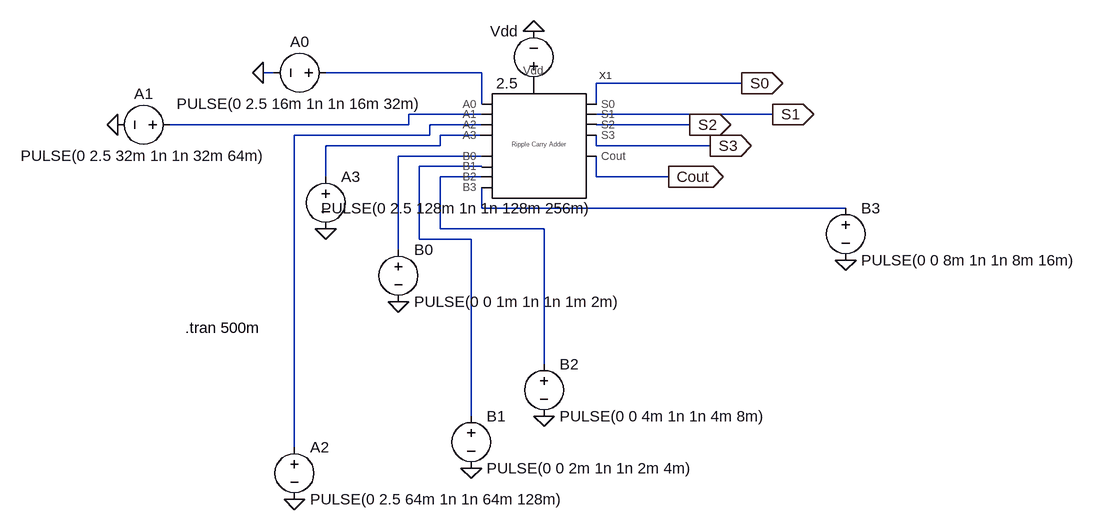
[diagram p0: schematic RippleAdder_transient.asc]
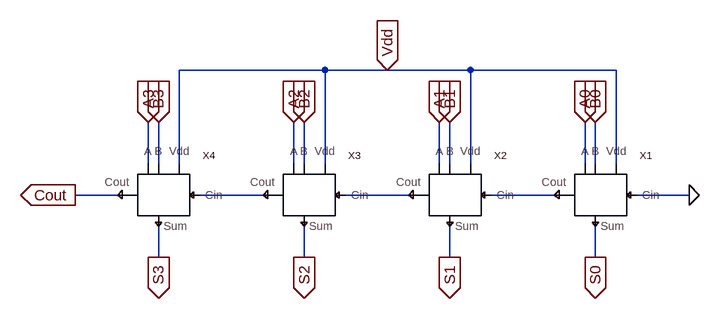
[diagram p1: sub-circuit rippleadder.asc]
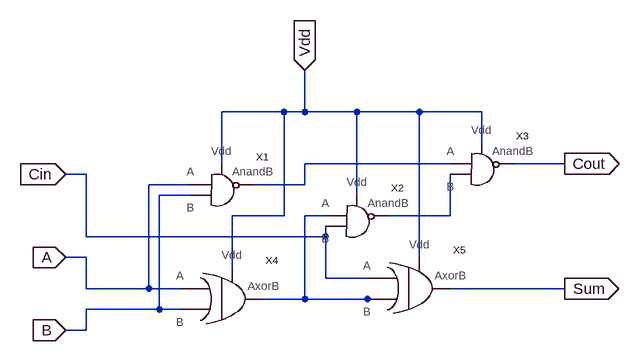
[diagram p2: sub-circuit fa.asc]
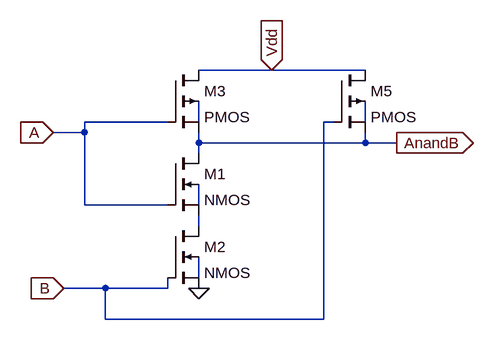
[diagram p3: sub-circuit nand.asc]
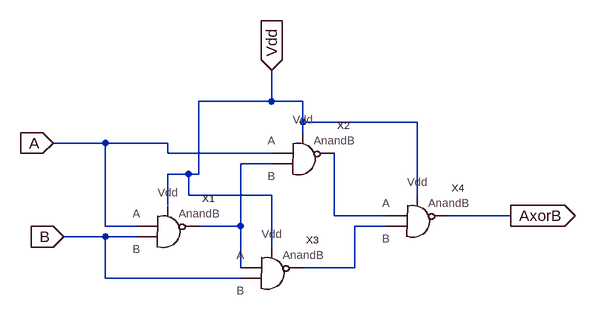
[diagram p4: sub-circuit xor.asc]
RippleAdder_transient.asc, the LTspice schematic file:
Version 4
SHEET 1 1164 680
WIRE -112 -32 -128 -32
WIRE 208 -32 -32 -32
WIRE 608 -16 384 -16
WIRE 208 16 208 -32
WIRE 384 16 384 -16
WIRE 208 32 96 32
WIRE 656 32 384 32
WIRE 96 48 96 32
WIRE 96 48 -272 48
WIRE 208 48 128 48
WIRE 528 48 384 48
WIRE 128 64 128 48
WIRE 128 64 -80 64
WIRE 208 64 144 64
WIRE 144 80 144 64
WIRE 144 80 -32 80
WIRE 384 80 384 64
WIRE 560 80 384 80
WIRE 208 96 80 96
WIRE 208 112 112 112
WIRE -32 128 -32 80
WIRE 208 128 144 128
WIRE 384 128 384 96
WIRE 496 128 384 128
WIRE 208 176 208 144
WIRE 768 176 208 176
WIRE 144 208 144 128
WIRE 304 208 144 208
WIRE 112 224 112 112
WIRE 192 224 112 224
WIRE 80 240 80 96
WIRE 304 416 304 208
WIRE 192 496 192 224
WIRE -80 544 -80 64
FLAG -32 208 0
FLAG -80 624 0
FLAG -352 48 0
FLAG -128 -32 0
FLAG 192 576 0
FLAG 304 496 0
FLAG 768 256 0
FLAG 80 320 0
FLAG 288 -96 0
FLAG 608 -16 S0
IOPIN 608 -16 Out
FLAG 656 32 S1
IOPIN 656 32 Out
FLAG 528 48 S2
IOPIN 528 48 Out
FLAG 560 80 S3
IOPIN 560 80 Out
FLAG 496 128 Cout
IOPIN 496 128 Out
SYMBOL RippleAdder 288 64 R0
SYMATTR InstName X1
SYMBOL voltage -16 -32 R90
WINDOW 0 -32 56 VBottom 2
WINDOW 3 32 56 VTop 2
WINDOW 123 0 0 Left 0
WINDOW 39 0 0 Left 0
SYMATTR InstName A0
SYMATTR Value PULSE(0 2.5 16m 1n 1n 16m 32m)
SYMBOL voltage -256 48 R90
WINDOW 0 -32 56 VBottom 2
WINDOW 3 32 56 VTop 2
WINDOW 123 0 0 Left 0
WINDOW 39 0 0 Left 0
SYMATTR InstName A1
SYMATTR Value PULSE(0 2.5 32m 1n 1n 32m 64m)
SYMBOL voltage -32 112 R0
WINDOW 3 -7 64 Left 2
WINDOW 123 0 0 Left 0
WINDOW 39 0 0 Left 0
SYMATTR Value PULSE(0 2.5 128m 1n 1n 128m 256m)
SYMATTR InstName A3
SYMBOL voltage -80 528 R0
WINDOW 123 0 0 Left 0
WINDOW 39 0 0 Left 0
SYMATTR InstName A2
SYMATTR Value PULSE(0 2.5 64m 1n 1n 64m 128m)
SYMBOL voltage 80 224 R0
WINDOW 123 0 0 Left 0
WINDOW 39 0 0 Left 0
SYMATTR InstName B0
SYMATTR Value PULSE(0 0 1m 1n 1n 1m 2m)
SYMBOL voltage 192 480 R0
WINDOW 123 0 0 Left 0
WINDOW 39 0 0 Left 0
SYMATTR InstName B1
SYMATTR Value PULSE(0 0 2m 1n 1n 2m 4m)
SYMBOL voltage 304 400 R0
WINDOW 123 0 0 Left 0
WINDOW 39 0 0 Left 0
SYMATTR InstName B2
SYMATTR Value PULSE(0 0 4m 1n 1n 4m 8m)
SYMBOL voltage 768 160 R0
WINDOW 123 0 0 Left 0
WINDOW 39 0 0 Left 0
SYMATTR InstName B3
SYMATTR Value PULSE(0 0 8m 1n 1n 8m 16m)
SYMBOL voltage 288 0 R180
WINDOW 0 24 96 Left 2
WINDOW 3 24 16 Left 2
WINDOW 123 0 0 Left 0
WINDOW 39 0 0 Left 0
SYMATTR InstName Vdd
SYMATTR Value 2.5
TEXT -248 360 Left 2 !.tran 500m

rippleadder.asc, the sub-circuit schematic file:
Version 4
SHEET 1 880 680
WIRE 32 -32 -192 -32
WIRE 128 -32 32 -32
WIRE 256 -32 128 -32
WIRE 480 -32 256 -32
WIRE -240 112 -240 48
WIRE -224 112 -224 48
WIRE -192 112 -192 -32
WIRE -16 112 -16 48
WIRE 0 112 0 48
WIRE 32 112 32 -32
WIRE 208 112 208 48
WIRE 224 112 224 48
WIRE 256 112 256 -32
WIRE 432 112 432 48
WIRE 448 112 448 48
WIRE 480 112 480 -32
WIRE -288 160 -352 160
WIRE -64 160 -160 160
WIRE 160 160 64 160
WIRE 384 160 288 160
WIRE 592 160 512 160
WIRE -224 256 -224 208
WIRE 0 256 0 208
WIRE 224 256 224 208
WIRE 448 256 448 208
FLAG 592 160 0
FLAG 432 48 A0
IOPIN 432 48 In
FLAG 448 48 B0
IOPIN 448 48 In
FLAG 208 48 A1
IOPIN 208 48 In
FLAG 224 48 B1
IOPIN 224 48 In
FLAG 0 48 B2
IOPIN 0 48 In
FLAG -224 48 B3
IOPIN -224 48 In
FLAG -240 48 A3
IOPIN -240 48 In
FLAG -16 48 A2
IOPIN -16 48 In
FLAG 128 -32 Vdd
IOPIN 128 -32 In
FLAG -224 256 S3
IOPIN -224 256 Out
FLAG 0 256 S2
IOPIN 0 256 Out
FLAG 224 256 S1
IOPIN 224 256 Out
FLAG 448 256 S0
IOPIN 448 256 Out
FLAG -352 160 Cout
IOPIN -352 160 Out
SYMBOL FA 464 176 R0
SYMATTR InstName X1
SYMBOL FA 240 176 R0
SYMATTR InstName X2
SYMBOL FA 16 176 R0
SYMATTR InstName X3
SYMBOL FA -208 176 R0
SYMATTR InstName X4

fa.asc, the sub-circuit schematic file:
Version 4
SHEET 1 880 680
WIRE -16 -48 -112 -48
WIRE 16 -48 16 -112
WIRE 16 -48 -16 -48
WIRE 96 -48 16 -48
WIRE 192 -48 96 -48
WIRE 288 -48 192 -48
WIRE 288 0 288 -48
WIRE -112 32 -112 -48
WIRE 240 32 16 32
WIRE 416 32 336 32
WIRE -320 48 -352 48
WIRE -160 64 -224 64
WIRE 16 64 16 32
WIRE 16 64 -64 64
WIRE -160 80 -208 80
WIRE 96 80 96 -48
WIRE -16 112 -16 -48
WIRE -16 112 -96 112
WIRE 48 112 16 112
WIRE 240 112 240 48
WIRE 240 112 144 112
WIRE -320 144 -320 48
WIRE 48 144 48 128
WIRE 48 144 -320 144
WIRE -320 176 -352 176
WIRE 192 176 192 -48
WIRE -96 192 -96 112
WIRE 48 208 48 144
WIRE 112 208 48 208
WIRE -320 224 -320 176
WIRE -224 224 -224 64
WIRE -224 224 -320 224
WIRE -176 224 -224 224
WIRE 416 224 240 224
WIRE 16 240 16 112
WIRE 16 240 -48 240
WIRE 112 240 16 240
WIRE 128 240 112 240
WIRE -208 256 -208 80
WIRE -208 256 -320 256
WIRE -176 256 -208 256
WIRE -320 288 -320 256
WIRE -320 288 -352 288
FLAG 416 224 Sum
IOPIN 416 224 Out
FLAG 416 32 Cout
IOPIN 416 32 Out
FLAG -352 48 Cin
IOPIN -352 48 In
FLAG -352 176 A
IOPIN -352 176 In
FLAG -352 288 B
IOPIN -352 288 In
FLAG 16 -112 Vdd
IOPIN 16 -112 In
SYMBOL NAND -64 112 R0
SYMATTR InstName X1
SYMBOL NAND 144 160 R0
SYMATTR InstName X2
SYMBOL NAND 336 80 R0
SYMATTR InstName X3
SYMBOL XOR -80 272 R0
SYMATTR InstName X4
SYMBOL XOR 208 256 R0
SYMATTR InstName X5

nand.asc, the sub-circuit schematic file:
Version 4
SHEET 1 880 680
WIRE 256 16 144 16
WIRE 400 16 256 16
WIRE 96 96 -32 96
WIRE 144 96 144 64
WIRE 352 96 336 96
WIRE 400 96 400 64
WIRE -32 112 -32 96
WIRE -32 112 -80 112
WIRE 144 128 144 112
WIRE 400 128 400 112
WIRE 400 128 144 128
WIRE 448 128 400 128
WIRE 144 144 144 128
WIRE -32 224 -32 112
WIRE 96 224 -32 224
WIRE 144 224 144 192
WIRE 144 256 144 240
WIRE 144 336 144 304
WIRE 0 352 -64 352
WIRE 96 352 96 336
WIRE 96 352 0 352
WIRE 0 400 0 352
WIRE 336 400 336 96
WIRE 336 400 0 400
FLAG 144 352 0
FLAG 448 128 AnandB
IOPIN 448 128 Out
FLAG -80 112 A
IOPIN -80 112 In
FLAG -64 352 B
IOPIN -64 352 In
FLAG 256 16 Vdd
IOPIN 256 16 In
SYMBOL nmos4 96 144 R0
SYMATTR InstName M1
SYMATTR Value2 l=2 w=10
SYMBOL nmos4 96 256 R0
SYMATTR InstName M2
SYMATTR Value2 l=2 w=10
SYMBOL pmos4 96 16 R0
SYMATTR InstName M3
SYMATTR Value2 l=2 w=10
SYMBOL pmos4 352 16 R0
SYMATTR InstName M5
SYMATTR Value2 l=2 w=10

xor.asc, the sub-circuit schematic file:
Version 4
SHEET 1 1324 680
WIRE 112 -256 112 -304
WIRE 112 -256 0 -256
WIRE 160 -256 112 -256
WIRE 160 -224 160 -256
WIRE 336 -224 160 -224
WIRE 160 -208 160 -224
WIRE -144 -192 -224 -192
WIRE -48 -192 -144 -192
WIRE -48 -176 -48 -192
WIRE 112 -176 -48 -176
WIRE 112 -160 64 -160
WIRE -16 -144 -48 -144
WIRE 0 -144 0 -256
WIRE 0 -144 -16 -144
WIRE -16 -112 -16 -144
WIRE 112 -112 -16 -112
WIRE 336 -112 336 -224
WIRE -48 -96 -48 -144
WIRE 208 -80 208 -176
WIRE 288 -80 208 -80
WIRE 480 -80 384 -80
WIRE -144 -64 -144 -192
WIRE -96 -64 -144 -64
WIRE 64 -64 64 -160
WIRE 64 -64 0 -64
WIRE 288 -64 240 -64
WIRE -144 -48 -208 -48
WIRE -96 -48 -144 -48
WIRE 112 -32 112 -112
WIRE 64 0 64 -64
WIRE 240 0 240 -64
WIRE 240 0 160 0
WIRE -144 16 -144 -48
WIRE 64 16 -144 16
FLAG -224 -192 A
IOPIN -224 -192 In
FLAG -208 -48 B
IOPIN -208 -48 In
FLAG 112 -304 Vdd
IOPIN 112 -304 In
FLAG 480 -80 AxorB
IOPIN 480 -80 Out
SYMBOL NAND 0 -16 R0
SYMATTR InstName X1
SYMBOL NAND 208 -128 R0
SYMATTR InstName X2
SYMBOL NAND 160 48 R0
SYMATTR InstName X3
SYMBOL NAND 384 -32 R0
SYMATTR InstName X4

The netlist it stands for:
* RippleAdder_transient.asc
XX1 P001 N001 N002 N003 N004 N005 N006 N007 N008 S0 S1 S2 S3 Cout rippleadder
V§A0 N001 0 PULSE(0 2.5 16m 1n 1n 16m 32m)
V§A1 N002 0 PULSE(0 2.5 32m 1n 1n 32m 64m)
V§A3 N004 0 PULSE(0 2.5 128m 1n 1n 128m 256m)
V§A2 N003 0 PULSE(0 2.5 64m 1n 1n 64m 128m)
V§B0 N005 0 PULSE(0 0 1m 1n 1n 1m 2m)
V§B1 N006 0 PULSE(0 0 2m 1n 1n 2m 4m)
V§B2 N007 0 PULSE(0 0 4m 1n 1n 4m 8m)
V§B3 N008 0 PULSE(0 0 8m 1n 1n 8m 16m)
Vdd P001 0 2.5

* block symbol definitions
.subckt rippleadder Vdd A0 A1 A2 A3 B0 B1 B2 B3 S0 S1 S2 S3 Cout
XX1 A0 B0 Vdd 0 N003 S0 fa
XX2 A1 B1 Vdd N003 N002 S1 fa
XX3 A2 B2 Vdd N002 N001 S2 fa
XX4 A3 B3 Vdd N001 Cout S3 fa
.ends rippleadder

.subckt fa A B Vdd Cin Cout Sum
XX1 A B N001 Vdd nand
XX2 N002 Cin N003 Vdd nand
XX3 N001 N003 Cout Vdd nand
XX4 N002 A B Vdd xor
XX5 Sum Cin N002 Vdd xor
.ends fa

.subckt nand A B AnandB Vdd
M1 AnandB A N004 N003 NMOS l=2 w=10
M2 N004 B 0 N005 NMOS l=2 w=10
M3 Vdd A AnandB N001 PMOS l=2 w=10
M5 Vdd B AnandB N002 PMOS l=2 w=10
.ends nand

.subckt xor AxorB A B Vdd
XX1 A B N001 Vdd nand
XX2 A N001 N002 Vdd nand
XX3 N001 B N003 Vdd nand
XX4 N002 N003 AxorB Vdd nand
.ends xor

.model NMOS NMOS
.model PMOS PMOS
.lib standard.mos
.tran 500m
.backanno
.end

* Results of the author's LTspice run, read from the files saved beside the schematic
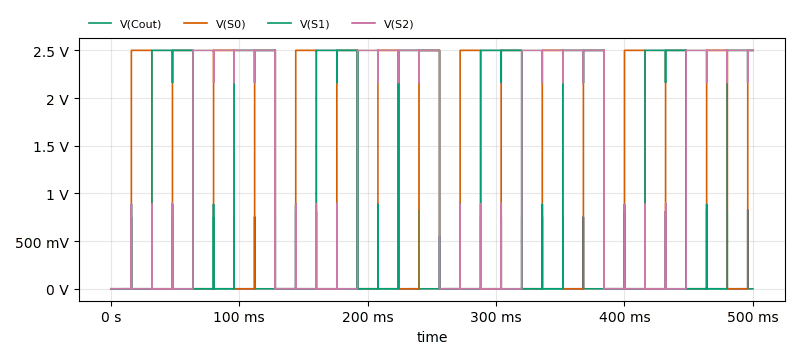
[diagram p5: Transient Analysis of RippleAdder_transient.asc, plotted from the saved traces]
* Transient Analysis, 1 run:
*   V(Cout): min 0 V, max 827.9 mV, average 94.65 nV, rms 89.54 µV, last 0 V
*   V(S0): min 0 V, max 2.5 V, average 1.22 V, rms 1.746 V, last 2.5 V
*   V(S1): min 0 V, max 2.5 V, average 1.22 V, rms 1.746 V, last 2.5 V
*   V(S2): min 0 V, max 2.5 V, average 1.22 V, rms 1.746 V, last 2.5 V